# Altium schematic sheet Inverter_Breakout.SchDoc: Inverter Breakout
size A4; Author: Chawthri K.; Organization: Waterloop; Address1: 200 University Ave W; Address2: Engineering 5, 1104; Address3: Waterloo, ON; Address4: N2L 3G1; Revision: 1; SheetNumber: 1; SheetTotal: 1
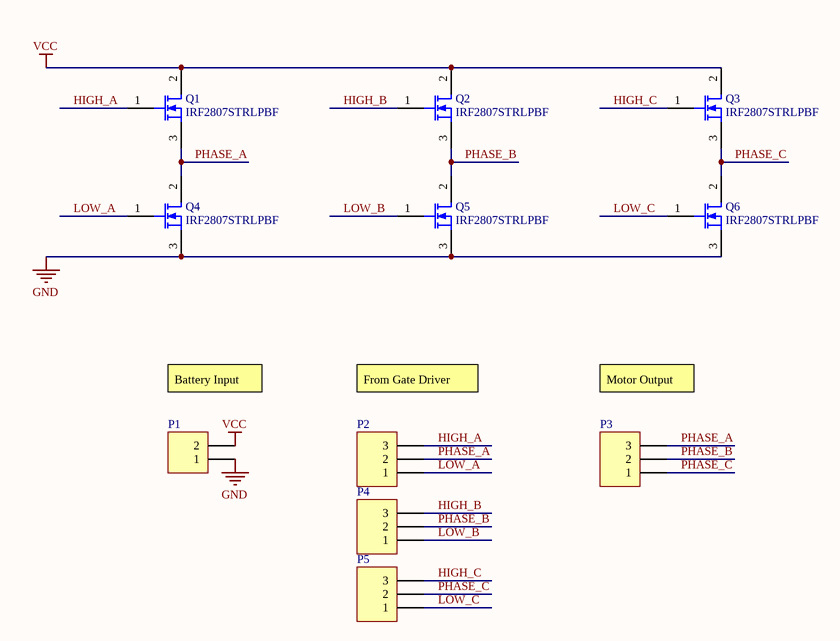
[diagram p0: Inverter_Breakout.SchDoc]

## Parts
P1  1x2 Header  [HDR1X2]  (value not drawn)
P2  1x3 Header  [HDR1X3]  (value not drawn)
P3  1x3 Header  [HDR1X3]  (value not drawn)
P4  1x3 Header  [HDR1X3]  (value not drawn)
P5  1x3 Header  [HDR1X3]  (value not drawn)
Q1  IRF2807STRLPBF  [TO2520AB]
Q2  IRF2807STRLPBF  [TO2520AB]
Q3  IRF2807STRLPBF  [TO2520AB]
Q4  IRF2807STRLPBF  [TO2520AB]
Q5  IRF2807STRLPBF  [TO2520AB]
Q6  IRF2807STRLPBF  [TO2520AB]

## Nets
GND: P1.1 Q4.3(S) Q5.3(S) Q6.3(S)
VCC: P1.2 Q1.2(D) Q2.2(D) Q3.2(D)
HIGH_A: P2.3 Q1.1(G)
HIGH_B: P4.3 Q2.1(G)
HIGH_C: P5.3 Q3.1(G)
LOW_A: P2.1 Q4.1(G)
LOW_B: P4.1 Q5.1(G)
LOW_C: P5.1 Q6.1(G)
PHASE_A: P2.2 P3.3 Q1.3(S) Q4.2(D)
PHASE_B: P3.2 P4.2 Q2.3(S) Q5.2(D)
PHASE_C: P3.1 P5.2 Q3.3(S) Q6.2(D)

## Notes on the sheet
- Battery Input
- From Gate Driver
- Motor Output
- Title:
- Size:
- Date:
- A4
- Author:
- Revision:
- Sheet
- of
- File:

## Library data of the parts
P1 = 1x2 Header: 1x2 Pin Header
P2-P5 = 1x3 Header: 1x3 Pin Header
Q1-Q6 = MOSFET-N: Manufacturer: Infineon; Rating: 75V 82A; Supplier: Digikey; Manufacturer Part Number: IRF2807STRLPBF; Supplier Part Number: IRF2807STRLPBFCT-ND
  Q2 Q3 Q5 Q6: Value: *